# EAGLE design USB to UART �Adapter (EAGLE 6.0)
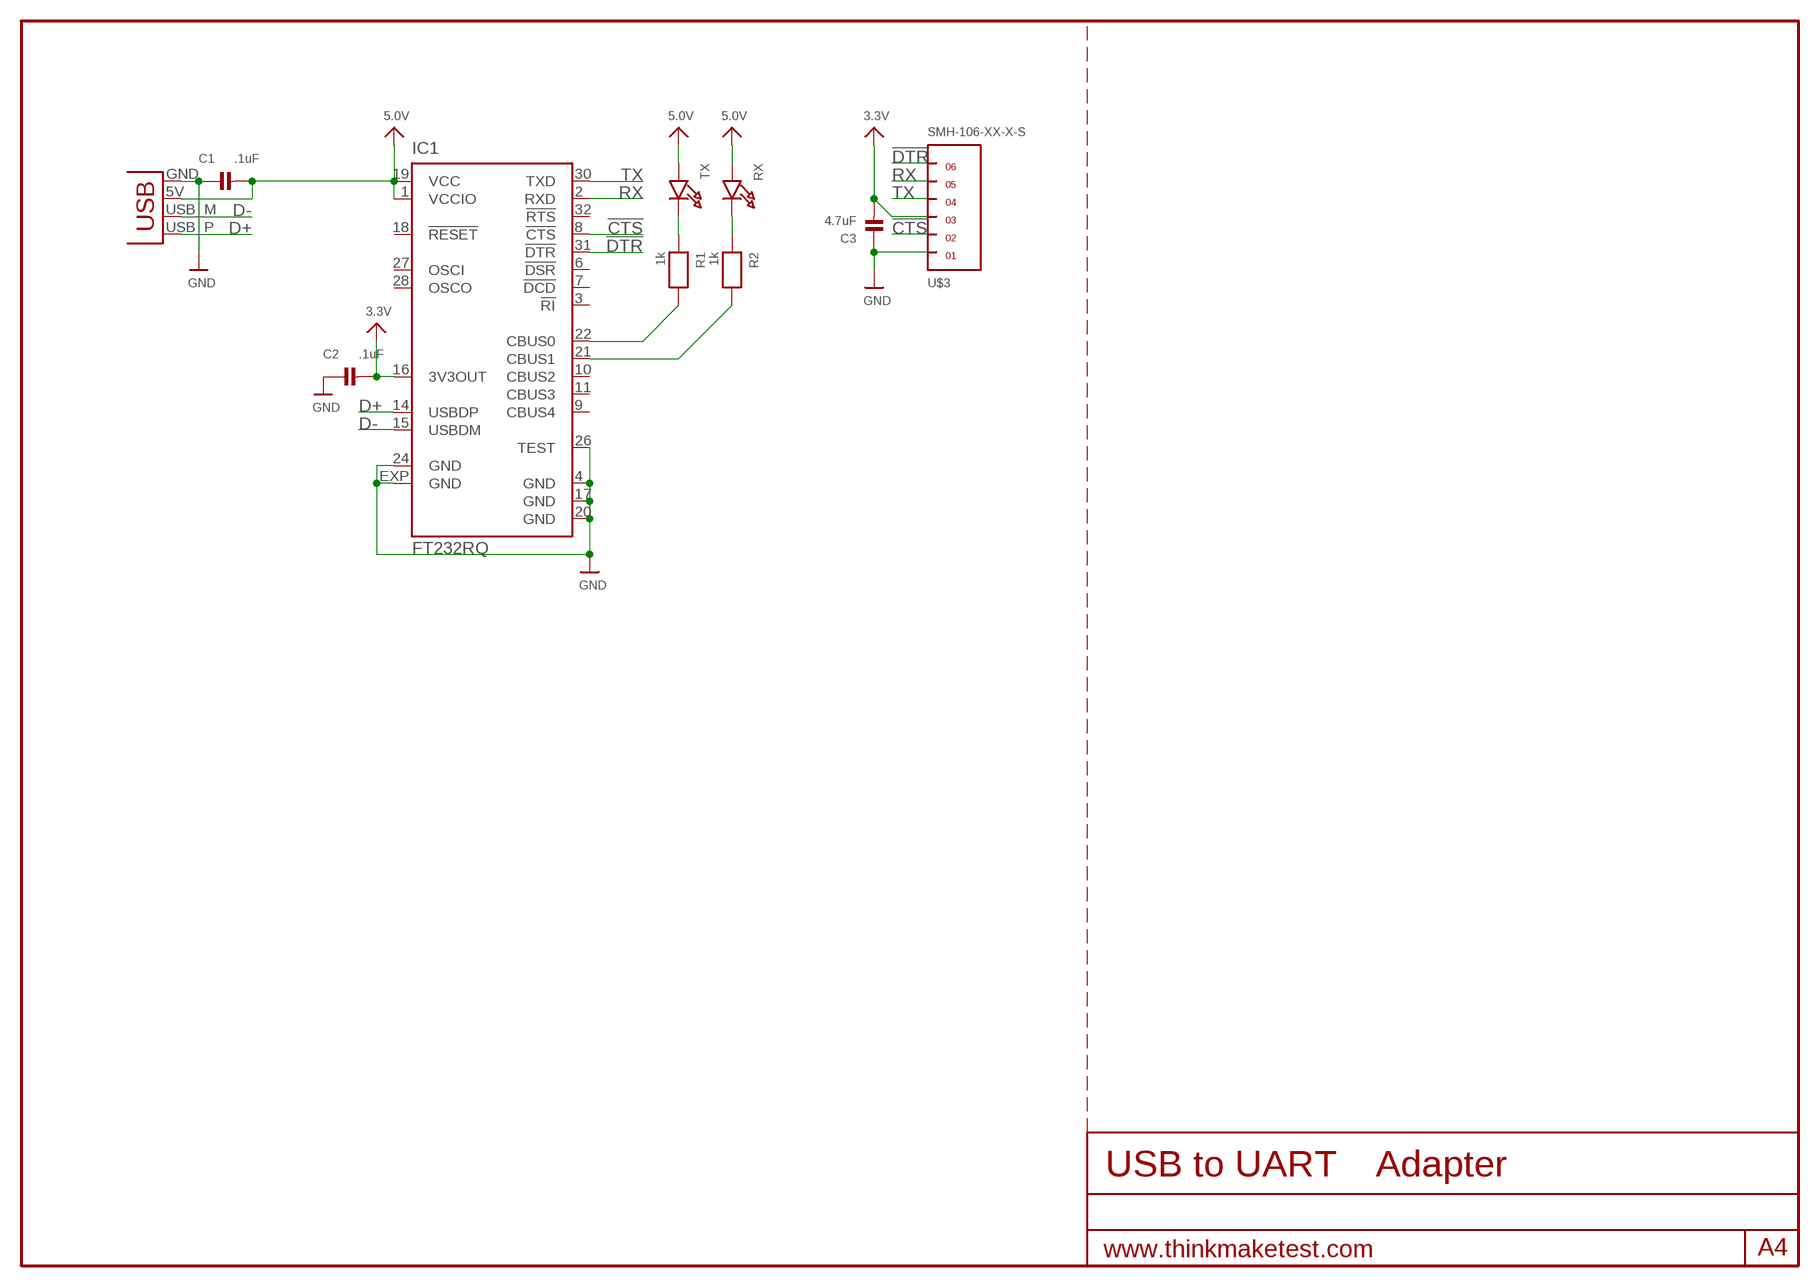
[diagram p0: schematic, sheet 1]

## Parts
C1  .1uF  CAP_CERAMIC0402  [0402]
C2  .1uF  CAP_CERAMIC0402  [0402]
C3  4.7uF  CAP_CERAMIC0603  [0603]
IC1  FT232RQ  [QFN32]
R1  1k  RESISTOR0402  [0402]
R2  1k  RESISTOR0402  [0402]
RX  LED0603  [CHIPLED_0603]
TX  LED0603  [CHIPLED_0603]
U$3  SMH-106-XX-X-S  [SMH-106-XX-X-S]
X1  USBPCB  [USB-A-PCB]

## Nets
3.3V: C2.2 C3.2 IC1.16(3V3OUT) U$3.3
5.0V: C1.2 IC1.1(VCCIO) IC1.19(VCC) RX.A TX.A X1.5V(VBUS)
!CTS: IC1.8(!CTS) U$3.2
!DTR: IC1.31(!DTR) U$3.6
D+: IC1.14(USBDP) X1.USB_P(D+)
D-: IC1.15(USBDM) X1.USB_M(D-)
GND: C1.1 C2.1 C3.1 IC1.4(GND) IC1.17(GND) IC1.20(GND) IC1.24(GND) IC1.26(TEST) IC1.EXP(GND) U$3.1 X1.GND
N$1: R2.1 RX.C
N$2: IC1.22(CBUS0) R1.2
N$3: R1.1 TX.C
N$4: IC1.21(CBUS1) R2.2
RX: IC1.2(RXD) U$3.5
TX: IC1.30(TXD) U$3.4
Unconnected: IC1.3(!RI) IC1.6(!DSR) IC1.7(!DCD) IC1.9(CBUS4) IC1.10(CBUS2) IC1.11(CBUS3) IC1.18(!RESET) IC1.27(OSCI) IC1.28(OSCO) IC1.32(!RTS)

## Library data of the parts
C1-C3 = microbuilder:CAP_CERAMIC: Ceramic Capacitors 0402 - 0402 Surface Mount Capacitors 0.1uF 10V 10% [Digikey: 490-1318-2-ND] 0603 - 0603 Surface Mount Capacitors 16 pF 50V 5% [Digikey: 445-5051-2-ND] 22 pF 50V [Digikey: PCC220ACVTR-ND] 33 pF 50V 5% [Digikey: 490-1415-1-ND] 56pF 50V 5% [Digikey: 490-1421-1-ND] 220pF 50V 5% [Digikey: 445-1285-1-ND] 680 pF 50V 2200 pF 50V 5% C0G [Digikey: 445-1297-1-ND] 5600 pF 100V 5% X7R [Digikey: 478-3711-1-ND] 0.1 µF 25V 10% [Digikey: PCC2277TR-ND] 0.22 µF 16V 10% X7R [Digikey: 445-1318-1-ND] 1.0 µF 25V 10% [Digikey: 445-5146-2-ND] 0603 - RF Specific 3pF 250V +/-0.1pF RF [Digikey: 712-1347-1-ND] 18 pF 250V 5% [Digikey: 478-3505-1-ND or 712-1322-1-ND] 56 pF 250V 5% C0G RF [Digikey: 490-4867-1-ND] 68 pF 250V RF [Digikey: 490-4868-1-ND] 0805 - 0805 Surface Mount Capacitors 220 pF 250V 2% RF Ceramic Capacitor [Digikey: 712-1398-1-ND] 1000 pF 50V 2% NP0 Ceramic Capacitor [Digikey: 478-3760-1-ND] 0.1 µF 25V 10% Ceramic Capacitor [Digikey: PCC1828TR-ND] 1.0 µF 16V 10% Ceramic Capacitor[Digikey: 490-1691-2-ND] 10.0 µF 10V 10% Ceramic Capacitor[Digikey: 709-1228-1-ND] 1206 - 1206 Surface Mount Capacitors
IC1 = ftdichip:FT232R: Source: http://www.ftdichip.com/Documents/DataSheets/DS_FT232R_v104.pdf
R1 R2 = microbuilder:RESISTOR: Resistors 0402 - 0402 Surface Mount Package 10.0K 1% 1/16W [Digikey: 311-10.0KLRTR-ND] 0603 - 0603 Surface Mount Package 0 Ohm 1/10 Watt 1% Resistor 15 Ohm 1/10 Watt 1% Resistor 33 Ohm 1/10 Watt 1% Resistor 49.9 Ohm 1/10 Watt 1% Resistor 100 Ohm 1/10 Watt 1% Resistor 150 Ohm 1/10 Watt 1% Resistor 240 Ohm 1/10 Watt 1% Resistor 390 Ohm 1/10 Watt 1% Resistor 560 Ohm 1/10 Watt 1% Resistor 750 Ohm 1/10 Watt 1% Resistor 1.0K Ohm 1/10 Watt 1% Resistor 1.5K Ohm 1/10 Watt 1% Resistor 2.0K Ohm 1/10 Watt 1% Resistor 4.7K Ohm 1/10 Watt 1% Resistor 10.0K Ohm 1/10 Watt 1% Resistor 20.0K Ohm 1/10 Watt 1% Resistor 33.0K Ohm 1/10 Watt 1% Resistor 100.0K Ohm 1/10 Watt 1% Resistor 0805 - 0805 Surface Mount Package 0 Ohm 1/8 Watt 1% Resistor 33 Ohm 1/8 Watt 1% Resistor 100 Ohm 1/8 Watt 1% Resistor 150 Ohm 1/8 Watt 1% Resistor 200 Ohm 1/8 Watt 1% Resistor 240 Ohm 1/8 Watt 1% Resistor 330 Ohm 1/8 Watt 1% Resistor 390 Ohm 1/8 Watt 1% Resistor 470 Ohm 1/8 Watt 1% Resistor 1.0K Ohm 1/8 Watt 1% Resistor 1.5K Ohm 1/8 Watt 1% Resistor 2.0K Ohm 1/8 Watt 1% Resistor 4.7K Ohm 1/8 Watt 1% Resistor 5.1K Ohm 1/8 Watt 1% Resistor 5.6K Ohm 1/8 Watt 1% Resistor 10.0K Ohm 1/8 Watt 1% Resistor 22.0K Ohm 1/8 Watt 1% Resistor 33.0K Ohm 1/8 Watt 1% Resistor 100K Ohm 1/8 Watt 1% Resistor 1206 - 1206 Surface Mount Package
RX TX = microbuilder:LED: LED 0603 - 0603 Surface Mount Package Green LED - Low Power (3.9mcd, 2ma, 1.7Vf) Orange LED - Low Power (9.8mcd, 2ma, 1.8Vf) Red LED - Low Power (5mcd, 2ma, 1.8Vf) Yellow LED - Low Power (7mcd, 2ma, 1.8Vf) 0805 - 0805 Surface Mount Package 20mA: Red LED (104mcd, 20mA, Diffused) - LS R976 [Digikey: 475-1278-6-ND] Red LED (12mcd, 20mA, 2.0Vf, Clear) - APT2012EC [Digikey: 754-1128-1-ND] Green LED (15mcd, 20mA, 2.2Vf, Clear) - APT2012GC [Digikey: 754-1131-1-ND] Orange LED (160mcd, 20mA, 2.1Vf, Clear) - APT2012SECK [Digikey: 754-1130-1-ND] 2mA: Red LED (8.8mcd, 2mA, 1.8Vf, Clear) - Low Power [Digikey: 475-2510-1-ND] Green LED (5mcd, 2mA, 1.8Vf, Clear) - Low Power [Digikey: 475-2730-1-ND] Yellow LED (11.3mcd, 2mA, 1.8Vf, Clear) - Low Power [Digikey: 475-2555-1-ND] 1206 - 1206 Surface Mount Package Green LED (26mcd, 20mA, Diffused) - LG N971 [Digikey: 475-1407-6-ND] Red LED (15mcd, 20mA, Diffused) - LH N974 [Digikey: 475-1416-6-ND]
U$3 = samtec:SMH-106-XX-X-S
X1 = SparkFun:USB: USB Connectors USB-B-PTH is fully proven SKU : PRT-00139 USB-miniB is fully proven SKU : PRT-00587 USB-A-PCB is untested. USB-A-H is throughly reviewed, but untested. Spark Fun Electronics SKU : PRT-00437 USB-B-SMT is throughly reviewed, but untested. Needs silkscreen touching up. USB-A-S has not been used/tested USB-MB-H has not been used/tested

## Board
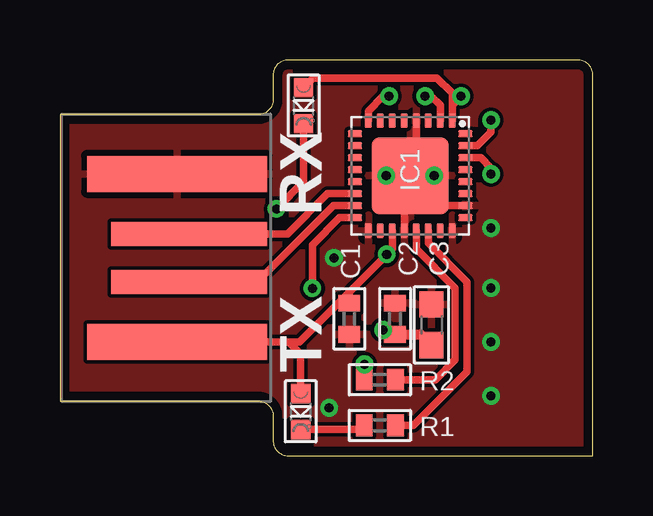
[diagram p1: board, top side]
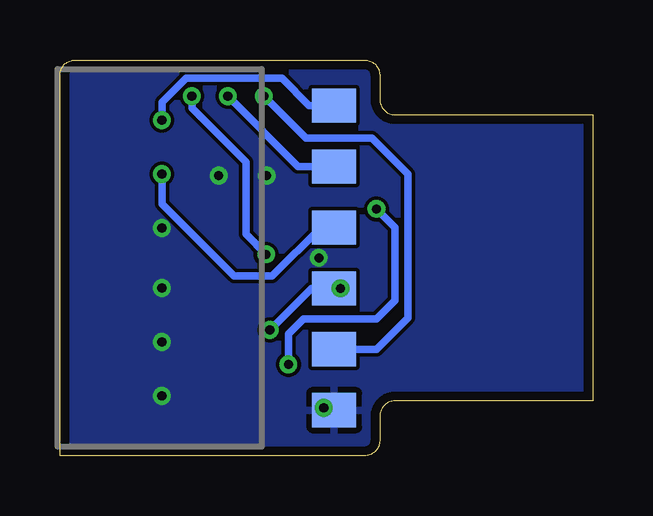
[diagram p2: board, bottom side, seen from below]

Size 22.23 x 16.51 mm. Coordinates in mm from the lower left corner, seen from the top.
Outline: 8.89,14.86 arc-90 8.26,14.22 0,14.22 0,2.29 8.26,2.29 arc-90 8.89,1.65 8.89,0.64 arc90 9.53,0 22.23,0 22.23,15.88 arc90 21.59,16.51 9.53,16.51 arc90 8.89,15.88 8.89,14.86
Copper layers (1*16): Top 0.0356mm / dielectric 1.5011mm / Bottom 0.0356mm
Design rules: minimum track width 6mil, minimum drill 13mil, track to track 6mil, track to pad 6mil, pad to pad 6mil, via to via 6mil, smd to smd 6mil, copper to edge 15mil, drill to drill 6mil, minimum pad ring 7mil, minimum via ring 7mil, stop-mask expansion 4mil, vias tented up to drill 0mil, thermal gap 10mil

### Footprints (pad centres in the part's own frame; a part is rotated, then mirrored left to right if it is on the bottom)
0402 = smd 0.7 x 0.9: 1 -0.65,0; 2 0.65,0
0603 = smd 1.1 x 1: 1 -0.85,0; 2 0.85,0
QFN32 = smd 0.6 x 0.3: 1 -2.3,1.75; 2 -2.3,1.25; 3 -2.3,0.75; 4 -2.3,0.25; 5 -2.3,-0.25; 6 -2.3,-0.75; 7 -2.3,-1.25; 8 -2.3,-1.75; 17 2.3,-1.75; 18 2.3,-1.25; 19 2.3,-0.75; 20 2.3,-0.25; 21 2.3,0.25; 22 2.3,0.75; 23 2.3,1.25; 24 2.3,1.75 | smd 0.3 x 0.6: 9 -1.75,-2.3; 10 -1.25,-2.3; 11 -0.75,-2.3; 12 -0.25,-2.3; 13 0.25,-2.3; 14 0.75,-2.3; 15 1.25,-2.3; 16 1.75,-2.3; 25 1.75,2.3; 26 1.25,2.3; 27 0.75,2.3; 28 0.25,2.3; 29 -0.25,2.3; 30 -0.75,2.3; 31 -1.25,2.3; 32 -1.75,2.3 | smd 3.2 x 3.2: EXP 0,0
CHIPLED_0603 = smd 0.8 x 0.8: A 0,-0.75; C 0,0.75
SMH-106-XX-X-S = smd 1.422 x 1.829: 1 -6.35,0; 2 -3.81,0; 3 -1.27,0; 4 1.27,0; 5 3.81,0; 6 6.35,0
USB-A-PCB = smd 7.5 x 1.5: 5V -0.2,-3.5; GND -0.2,3.5 | smd 6.5 x 1: USB_M 0.3,-1; USB_P 0.3,1

### Placement (x,y rotation side)
C1  12.06,5.71 90 top
C2  13.97,5.71 270 top
C3  15.49,5.46 270 top
IC1  14.61,11.68 270 top
R1  13.34,1.27 0 top
R2  13.34,3.17 0 top
RX  10.16,14.61 180 top
TX  10.04,1.84 180 top
U$3  10.79,8.26 90 bottom
X1  5.08,8.26 0 top

### Tracks (layer width: path | path; a pad name or v marks a point on that pad's centre or on a via)
3.3V  (via drill 0.38)
  Top 0.305: IC1.16 11.65,9.93 10.53,8.8 v10.53,6.99 | C2.2 13.66,5.07 v13.47,5.25
  Top 0.406: C2.2 15.04,5.07 C3.2
  Bottom 0.305: v10.53,6.99 U$3.3 11.74,6.99 v13.47,5.25
5.0V  (via drill 0.38)
  Top 0.305: 16.36,14.63 IC1.1 | v16.73,15 16.36,14.63 | 9.53,4.75 9.98,4.75 12.06,6.84 | X1.5V 9.53,4.75 | IC1.19 13.86,8.63 v13.62,8.4 12.06,6.84 | 12.06,6.84 C1.2 | TX.A 10.04,4.24 9.53,4.75 | 16.36,14.63 16.36,15.12 15.72,15.75 10.55,15.75 RX.A
  Bottom 0.305: v16.73,15 16.73,14.5 14.47,12.25 14.47,9.25 v13.62,8.4
!CTS  (via drill 0.38)
  Top 0.305: IC1.8 12.86,14.38 13.47,15 v13.72,15
  Bottom 0.305: v13.72,15 11.97,13.25 9.22,13.25 7.72,11.75 7.72,5.75 9.03,4.45 U$3.2
!DTR  (via drill 0.38)
  Top 0.305: IC1.31 17.41,12.93 17.98,13.5 v17.98,14
  Bottom 0.305: U$3.6 11.83,14.61 12.97,15.75 16.98,15.75 17.98,14.75 v17.98,14
D+
  Top 0.305: X1.USB_P 9.48,9.26 11.15,10.93 IC1.14
D-
  Top 0.254: 5.97,7.25 X1.USB_M
  Top 0.305: IC1.15 11.4,10.43 8.22,7.25 5.97,7.25
GND  (via drill 0.38)
  Top 0.305: IC1.4 14.86,11.93 IC1.EXP | IC1.20 14.36,11.93 IC1.EXP | IC1.26 15.86,10.43 IC1.EXP
  other vias: 11.22,2 15.61,11.68 13.61,11.68 17.98,9.5 17.98,7 17.98,4.75 17.98,2.5 11.43,8.26
  pour Bottom: 22.23,0 0,0 0,16.51 22.23,16.51
  pour Top: 0,0 0,16.51 22.23,16.51 22.23,0
N$1  (via drill 0.38)
  Top 0.305: RX.C 10.16,11.43 v9.03,10.29 | v12.7,3.81 12.7,3.19 R2.1
  Bottom 0.305: v9.03,10.29 8.26,9.53 8.26,6.49 9.03,5.71 12.06,5.71 12.7,5.08 v12.7,3.81
N$2
  Top 0.305: R1.2 14.74,1.27 16.98,3.5 16.98,7.25 15.36,8.87 IC1.22
N$3
  Top 0.305: TX.C 12.51,1.09 R1.1
N$4
  Top 0.305: R2.2 15.65,3.17 16.48,4 16.48,7 14.86,8.62 IC1.21
RX  (via drill 0.38)
  Top 0.305: IC1.2 15.86,14.62 15.47,15 v15.22,15
  Bottom 0.305: v15.22,15 12.29,12.06 U$3.5
TX  (via drill 0.38)
  Top 0.305: IC1.30 17.55,12.43 17.98,12 v17.98,11.75
  Bottom 0.305: U$3.4 11.35,9.53 13.38,7.5 14.97,7.5 17.98,10.5 v17.98,11.75

### Text on the board
tDocu: !DTR | RX | TX | 3.3v | !CTS | GND